# Altium schematic sheet charge_mode_preamplifier.SchDoc
size A
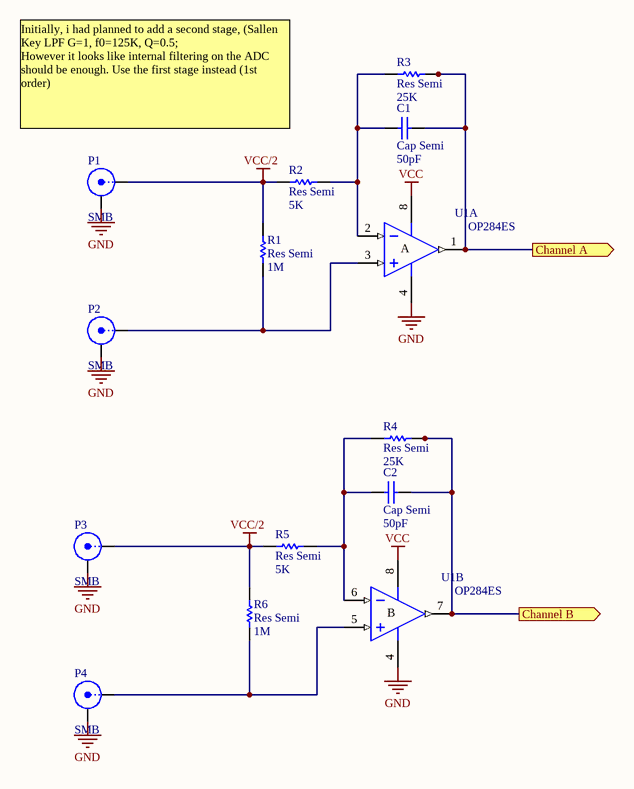
[diagram p0: charge_mode_preamplifier.SchDoc]

## Parts
C1  Cap Semi  value 50pF  [CAPC1005L]
C2  Cap Semi  value 50pF  [CAPC1005L]
P1  SMB  [SMB_V-RJ45]
P2  SMB  [SMB_V-RJ45]
P3  SMB  [SMB_V-RJ45]
P4  SMB  [SMB_V-RJ45]
R1  Res Semi  value 1M  [RESC1005L]
R2  Res Semi  value 5K  [RESC1005L]
R3  Res Semi  value 25K  [RESC1005L]
R4  Res Semi  value 25K  [RESC1005L]
R5  Res Semi  value 5K  [RESC1005L]
R6  Res Semi  value 1M  [RESC1005L]
U1  OP284ES  [SO-8_N]  (parts A,B of 2)

## Ports
Channel A  (out), Channel B  (out)

## Nets
GND: P1.2(Y) P2.2(Y) P3.2(Y) P4.2(Y) U1.4(V-)
VCC: U1.8(V+)
VCC/2 : P1.1(X) P3.1(X) R1.2 R2.1 R5.1 R6.2
Channel A : C1.2 R3.2 U1.1(OUT) ; port Channel A 
Channel B : C2.2 R4.2 U1.7(OUT) ; port Channel B 
NetC1_1: C1.1 R2.2 R3.1 U1.2(IN-)
NetC2_1: C2.1 R4.1 R5.2 U1.6(IN-)
NetP2_1: P2.1(X) R1.1 U1.3(IN+)
NetP4_1: P4.1(X) R6.1 U1.5(IN+)

## Notes on the sheet
- Initially, i had planned to add a second stage, (Sallen Key LPF G=1, f0=125K, Q=0.5;
  However it looks like internal filtering on the ADC should be enough. Use the first stage instead (1st order)
- (in symbol OP284ES, part A) A
- (in symbol OP284ES, part B) B

## Library data of the parts
C1 C2 = Cap Semi: Capacitor (Semiconductor SIM Model); Published: 8-Jun-2000; LatestRevisionDate: 29-May-2009; LatestRevisionNote: IPC-7351 Footprint Added.; PackageReference: C1206; Publisher: Altium Limited; PackageDescription: Chip Capacitor
P1-P4 = SMB: SMB Straight Connector; LatestRevisionDate: 17-Jul-2002; LatestRevisionNote: Re-released for DXP Platform.; Publisher: Altium Limited
R1-R6 = Res Semi: Semiconductor Resistor; Published: 8-Jun-2000; LatestRevisionDate: 17-Jul-2002; LatestRevisionNote: Re-released for DXP Platform.; PackageReference: AXIAL-0.5; Publisher: Altium Limited
U1 = OP284ES: Precision Rail-to-Rail Input and Output Operational Amplifier; Published: 8-Jun-2000; LatestRevisionDate: 13-Apr-2006; LatestRevisionNote: IPC-7351 Footprint Added.; DatasheetVersion: REV. 0 1996; PackageVersion: revA; PackageReference: SO-8; Publisher: Altium Limited; PackageDescription: 8-Pin Small Outline Integrated Circuit 1.27 mm Pitch; Code_JEDEC: MS-012-AA; Code_IPC: SOIC127P600-8; ComponentLink1Description: Manufacturer Link; ComponentLink1URL: http://www.analog.com/en/prod/0,,759_786_OP184%2C00.html; ComponentLink2Description: Datasheet; ComponentLink2URL: http://www.analog.com/UploadedFiles/Data_Sheets/390492658OP184_284_484_b.pdf; ComponentLink3Description: Discontinuation Notice; ComponentLink3URL: http://www.analog.com/UploadedFiles/Aerospace_Information/505817548385948813507767505obsolete.pdf